# Altium project PCB_Project.PrjPcb
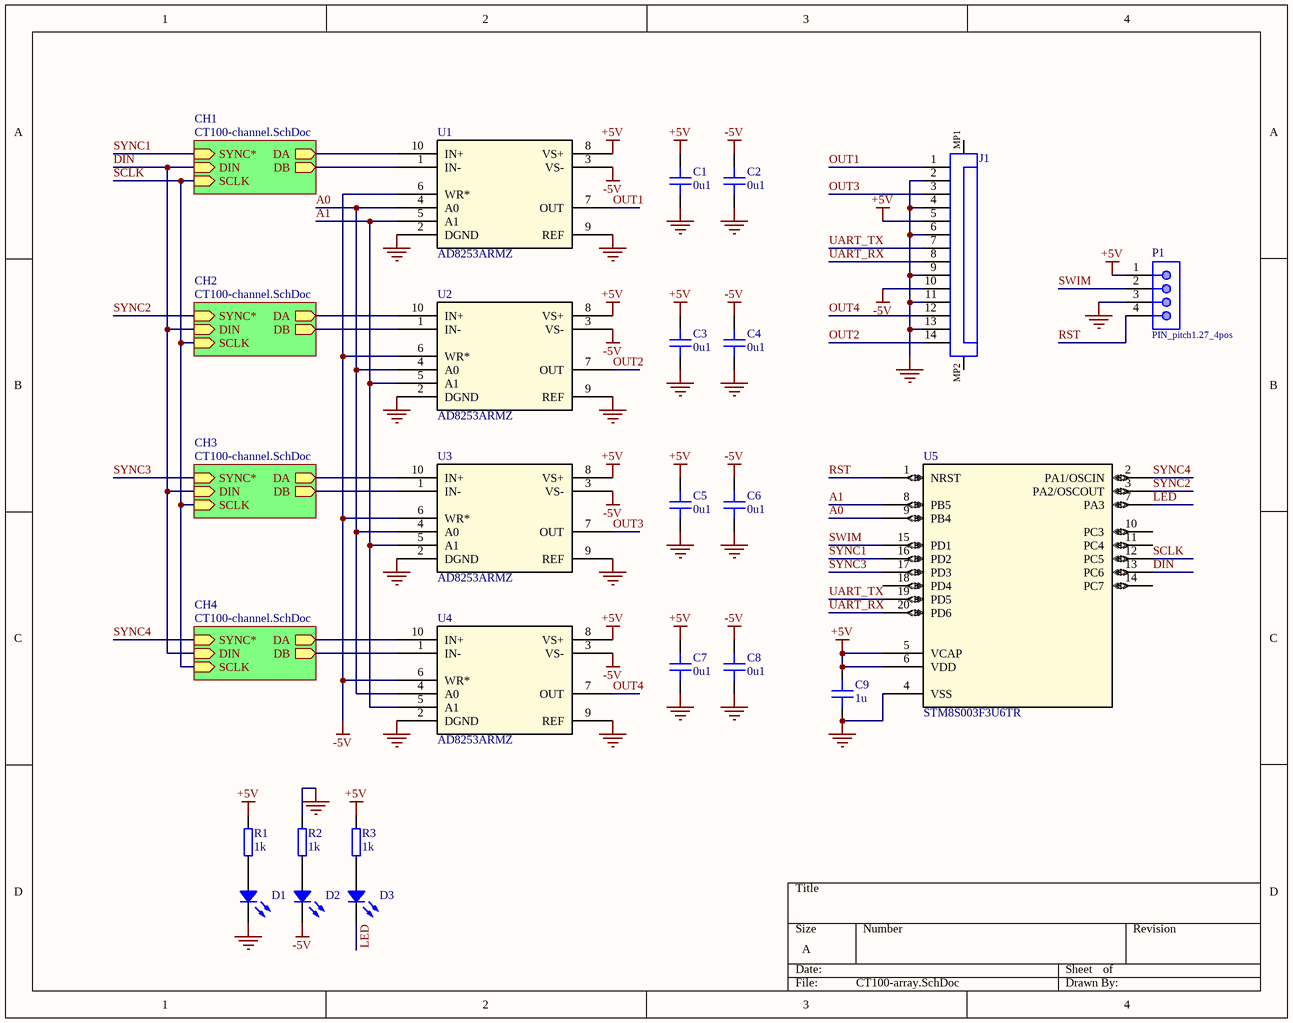
[diagram p0: CT100-array.SchDoc]
1 sheet, 22 parts. Net scope: hierarchical (ports join the sheet entries above them; power ports are global).
Board file: PCB.PcbDoc

## Sheet CT100-array.SchDoc
size A; SheetNumber: 1; SheetTotal: 2

### Parts
C1  0u1  [CAP_0402]
C2  0u1  [CAP_0402]
C3  0u1  [CAP_0402]
C4  0u1  [CAP_0402]
C5  0u1  [CAP_0402]
C6  0u1  [CAP_0402]
C7  0u1  [CAP_0402]
C8  0u1  [CAP_0402]
C9  1u  [CAP_0402]
D1  LED_0402  [LED_0402]  (value not drawn)
D2  LED_0402  [LED_0402]  (value not drawn)
D3  LED_0402  [LED_0402]  (value not drawn)
J1  FPC_pitch1_14pos  [FPC_pitch1_14pos]  (value not drawn)
P1  PIN_pitch1.27_4pos  [PIN_pitch1.27_4pos]
R1  1k  [RES_0402]
R2  1k  [RES_0402]
R3  1k  [RES_0402]
U1  AD8253ARMZ  [RM_10_ADI]
U2  AD8253ARMZ  [RM_10_ADI]
U3  AD8253ARMZ  [RM_10_ADI]
U4  AD8253ARMZ  [RM_10_ADI]
U5  STM8S003F3U6TR  [UFQFPN20_3x3x0p6]

### Sub-sheets
CH1 = CT100-channel.SchDoc (file not in this document): SYNC* (in), DIN (in), SCLK (in), DA (out), DB (out)
CH2 = CT100-channel.SchDoc (file not in this document): SYNC* (in), DIN (in), SCLK (in), DA (out), DB (out)
CH3 = CT100-channel.SchDoc (file not in this document): SYNC* (in), DIN (in), SCLK (in), DA (out), DB (out)
CH4 = CT100-channel.SchDoc (file not in this document): SYNC* (in), DIN (in), SCLK (in), DA (out), DB (out)

### Nets
+5V: C1.1 C3.1 C5.1 C7.1 C9.1 J1.5 P1.1 R1.2 R3.2 U1.8(VS+) U2.8(VS+) U3.8(VS+) U4.8(VS+) U5.5(VCAP) U5.6(VDD)
-5V: C2.1 C4.1 C6.1 C8.1 D2.2 J1.10 U1.3(VS-) U1.6(WR*) U2.3(VS-) U2.6(WR*) U3.3(VS-) U3.6(WR*) U4.3(VS-) U4.6(WR*)
GND: C1.2 C2.2 C3.2 C4.2 C5.2 C6.2 C7.2 C8.2 C9.2 D1.2 J1.2 J1.4 J1.6 J1.9 J1.11 J1.13 P1.3 R2.2 U1.2(DGND) U1.9(REF) U2.2(DGND) U2.9(REF) U3.2(DGND) U3.9(REF) U4.2(DGND) U4.9(REF) U5.4(VSS)
A0: U1.4(A0) U2.4(A0) U3.4(A0) U4.4(A0) U5.9(PB4)
A1: U1.5(A1) U2.5(A1) U3.5(A1) U4.5(A1) U5.8(PB5)
DIN: U5.13(PC6) ; sheet CH1/DIN, sheet CH2/DIN, sheet CH3/DIN, sheet CH4/DIN
LED: D3.2 U5.7(PA3)
OUT1: J1.1 U1.7(OUT)
OUT2: J1.14 U2.7(OUT)
OUT3: J1.3 U3.7(OUT)
OUT4: J1.12 U4.7(OUT)
RST: P1.4 U5.1(NRST)
SCLK: U5.12(PC5) ; sheet CH1/SCLK, sheet CH2/SCLK, sheet CH3/SCLK, sheet CH4/SCLK
SWIM: P1.2 U5.15(PD1)
SYNC1: U5.16(PD2) ; sheet CH1/SYNC*
SYNC2: U5.3(PA2/OSCOUT) ; sheet CH2/SYNC*
SYNC3: U5.17(PD3) ; sheet CH3/SYNC*
SYNC4: U5.2(PA1/OSCIN) ; sheet CH4/SYNC*
UART_RX: J1.8 U5.20(PD6)
UART_TX: J1.7 U5.19(PD5)
NetD1_1: D1.1 R1.1
NetD2_1: D2.1 R2.1
NetD3_1: D3.1 R3.1
NetU1_1: U1.1(IN-) ; sheet CH1/DB
NetU1_10: U1.10(IN+) ; sheet CH1/DA
NetU2_1: U2.1(IN-) ; sheet CH2/DB
NetU2_10: U2.10(IN+) ; sheet CH2/DA
NetU3_1: U3.1(IN-) ; sheet CH3/DB
NetU3_10: U3.10(IN+) ; sheet CH3/DA
NetU4_1: U4.1(IN-) ; sheet CH4/DB
NetU4_10: U4.10(IN+) ; sheet CH4/DA

Not connected (* = marked no-connect by the designer): J1 MP1 MP2; U5 10(PC3) 11(PC4) 14(PC7) 18(PD4)

### Library data of the parts
C1-C9 = CAP_0402: Capacitor SMD 0402; Voltage: 50V
  C1-C8: Capacitance: 0u1
  C9: Capacitance: 1u
D1-D3 = LED_0402: LED SMD 0402
J1 = FPC_pitch1_14pos: 14 Position 1 mm FFC & FPC Connectors
R1-R3 = RES_0402: Resistor SMD 0402; Resistance: 1k
U1-U4 = AD8253ARMZ: No Description Available; Mfr_Name: Analog Devices Inc; Copyright: Copyright (C) 2023 Ultra Librarian. All rights reserved.; Manufacturer_Part_Number: AD8253ARMZ; RefDes: RefDes; Type: DEV
U5 = STM8S003F3U6TR: No Description Available; Mfr_Name: STMicroelectronics; Copyright: Copyright (C) 2023 Ultra Librarian. All rights reserved.; Manufacturer_Part_Number: STM8S003F3U6TR; RefDes: RefDes; Type: Type